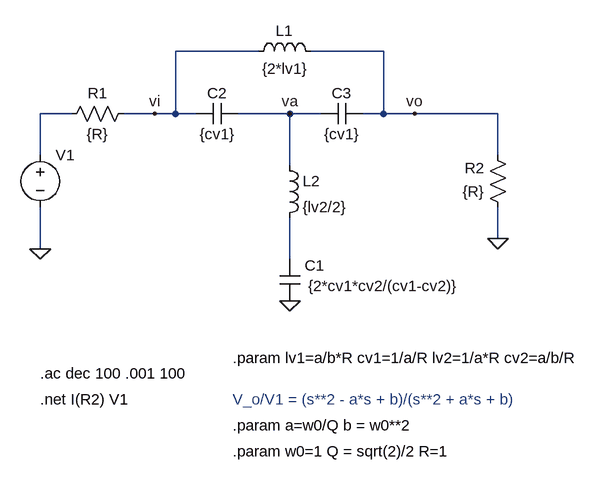
[diagram p0: schematic tee_puen_2ord_delay_eq.asc]
tee_puen_2ord_delay_eq.asc, the LTspice schematic file:
Version 4
SHEET 1 884 1328
WIRE 336 368 208 368
WIRE 528 368 416 368
WIRE 48 464 0 464
WIRE 176 464 128 464
WIRE 208 464 208 368
WIRE 208 464 176 464
WIRE 240 464 208 464
WIRE 384 464 304 464
WIRE 432 464 384 464
WIRE 528 464 528 368
WIRE 528 464 496 464
WIRE 576 464 528 464
WIRE 704 464 576 464
WIRE 0 528 0 464
WIRE 704 528 704 464
WIRE 384 544 384 464
WIRE 704 656 704 608
WIRE 0 672 0 608
WIRE 384 688 384 624
FLAG 0 672 0
FLAG 176 464 vi
FLAG 576 464 vo
FLAG 384 752 0
FLAG 704 656 0
FLAG 384 464 va
SYMBOL voltage 0 512 R0
WINDOW 3 24 96 Invisible 2
SYMATTR Value 0
SYMATTR InstName V1
SYMATTR Value2 AC 1 0
SYMATTR SpiceLine Rser=0
SYMBOL res 144 448 R90
WINDOW 0 0 56 VBottom 2
WINDOW 3 32 56 VTop 2
SYMATTR InstName R1
SYMATTR Value {R}
SYMBOL res 720 624 R180
WINDOW 0 36 76 Left 2
WINDOW 3 36 40 Left 2
SYMATTR InstName R2
SYMATTR Value {R}
SYMBOL cap 368 688 R0
WINDOW 0 39 10 Left 2
WINDOW 3 44 41 Left 2
SYMATTR InstName C1
SYMATTR Value {2*cv1*cv2/(cv1-cv2)}
SYMBOL ind 320 384 R270
WINDOW 0 32 56 VTop 2
WINDOW 3 5 56 VBottom 2
SYMATTR InstName L1
SYMATTR Value {2*lv1}
SYMATTR SpiceLine Rser=0
SYMBOL ind 368 528 R0
SYMATTR InstName L2
SYMATTR Value {lv2/2}
SYMATTR SpiceLine Rser=0
SYMBOL cap 304 448 R90
WINDOW 0 0 32 VBottom 2
WINDOW 3 32 32 VTop 2
SYMATTR InstName C2
SYMATTR Value {cv1}
SYMBOL cap 496 448 R90
WINDOW 0 0 32 VBottom 2
WINDOW 3 32 32 VTop 2
SYMATTR InstName C3
SYMATTR Value {cv1}
TEXT 0 904 Left 2 !.net I(R2) V1
TEXT 0 864 Left 2 !.ac dec 100 .001 100
TEXT 296 904 Left 2 ;V_o/V1 = (s**2 - a*s + b)/(s**2 + a*s + b)
TEXT 296 944 Left 2 !.param a=w0/Q b = w0**2
TEXT 296 984 Left 2 !.param w0=1 Q = sqrt(2)/2 R=1
TEXT 296 840 Left 2 !.param lv1=a/b*R cv1=1/a/R lv2=1/a*R cv2=a/b/R

The netlist it stands for:
* tee_puen_2ord_delay_eq.asc
V1 N001 0 0 AC 1 0 Rser=0
R1 vi N001 {R}
R2 0 vo {R}
C1 N002 0 {2*cv1*cv2/(cv1-cv2)}
L1 vi vo {2*lv1} Rser=0
L2 va N002 {lv2/2} Rser=0
C2 va vi {cv1}
C3 vo va {cv1}
.net I(R2) V1
.ac dec 100 .001 100
* V_o/V1 = (s**2 - a*s + b)/(s**2 + a*s + b)
.param a=w0/Q b = w0**2
.param w0=1 Q = sqrt(2)/2 R=1
.param lv1=a/b*R cv1=1/a/R lv2=1/a*R cv2=a/b/R
.backanno
.end